# Altium schematic sheet Sm_Rt_LED_Bu.SchDoc
size A4
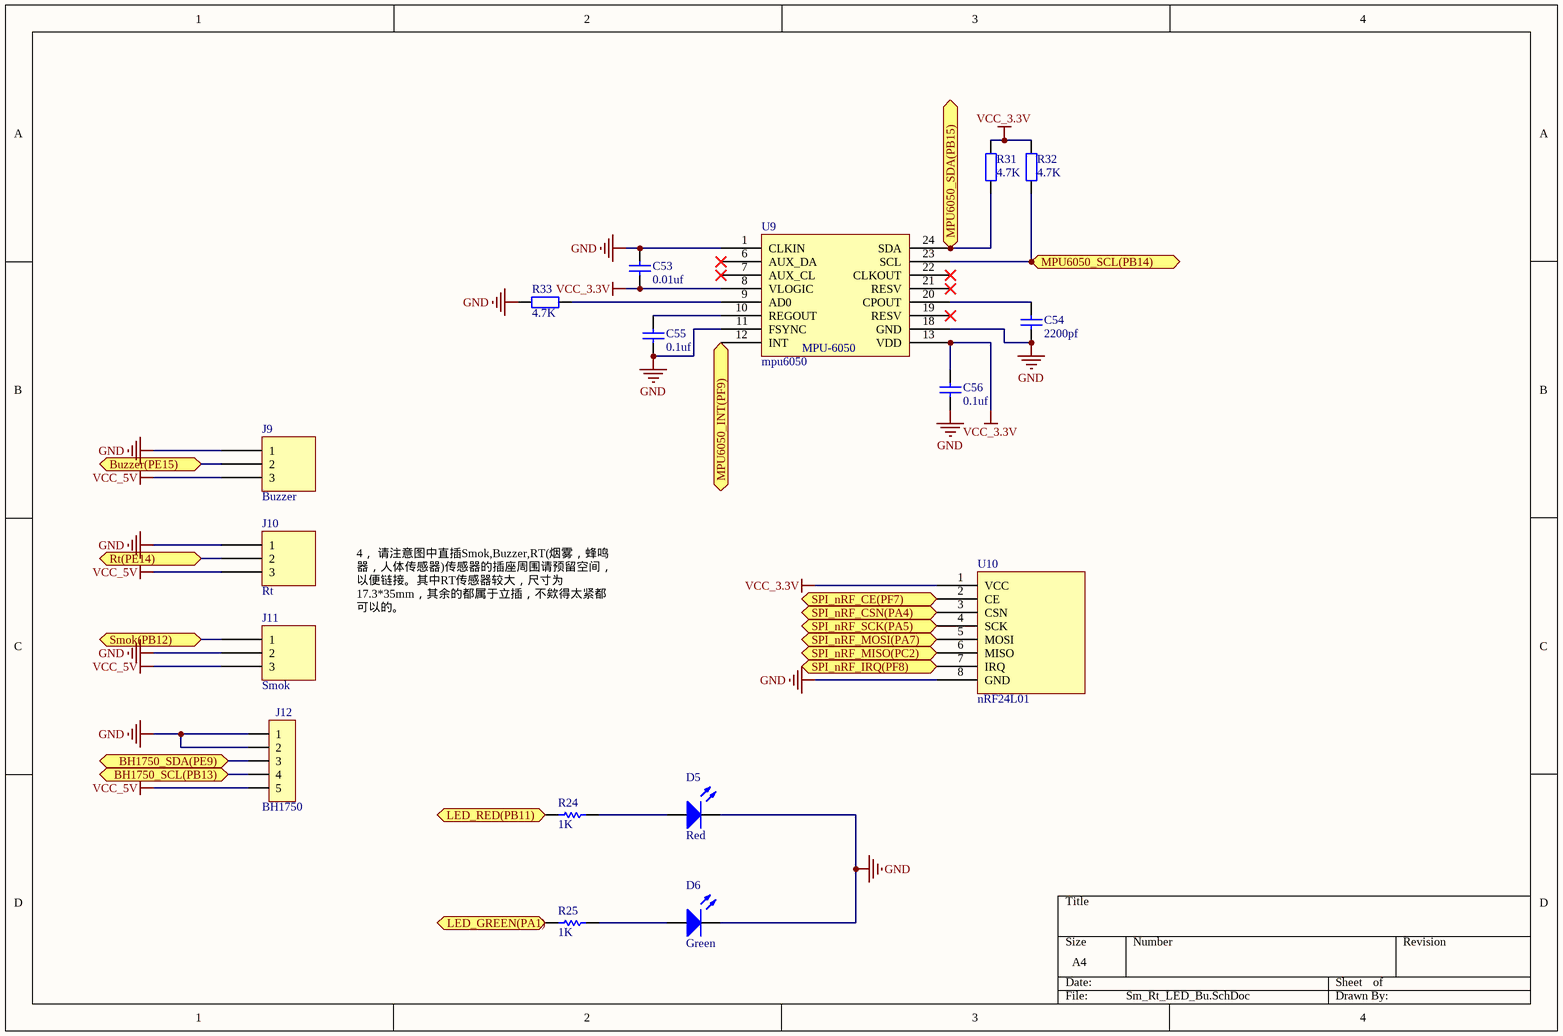
[diagram p0: Sm_Rt_LED_Bu.SchDoc]

## Parts
C53  0.01uf  [0603_C]
C54  2200pf  [0603_C]
C55  0.1uf  [0603_C]
C56  0.1uf  [0603_C]
D5  Red  [0805_LED_S1]
D6  Green  [0805_LED_S1]
J9  Buzzer  [HDR1X3]
J10  Rt  [HDR1X3]
J11  Smok  [HDR1X3]
J12  BH1750  [XH2.54-LI-5P]
R24  1K  [0603_R]
R25  1K  [0603_R]
R31  4.7K  [0603_R]
R32  4.7K  [0603_R]
R33  4.7K  [0603_R]
U9  mpu6050  [QFN-24_4x4x05P]
U10  nRF24L01  [AS01-spipx]

## Ports
BH1750_SCL(PB13) (bidir), BH1750_SDA(PE9) (bidir), Buzzer(PE15) (bidir), LED_GREEN(PA1) (bidir), LED_RED(PB11) (bidir), MPU6050_INT(PF9) (bidir), MPU6050_SCL(PB14) (bidir), MPU6050_SDA(PB15) (bidir), Rt(PE14) (bidir), Smok(PB12) (bidir), SPI_nRF_CE(PF7) (bidir), SPI_nRF_CSN(PA4) (bidir), SPI_nRF_IRQ(PF8) (bidir), SPI_nRF_MISO(PC2) (bidir), SPI_nRF_MOSI(PA7) (bidir), SPI_nRF_SCK(PA5) (bidir)

## Nets
GND: C53.2 C54.1 C55.1 C56.1 D5.K D6.K J9.1 J10.1 J11.2 J12.1 J12.2 R33.2 U9.1(CLKIN) U9.11(FSYNC) U9.18(GND) U10.8(GND)
VCC_3.3V: C53.1 C56.2 R31.2 R32.2 U9.8(VLOGIC) U9.13(VDD) U10.1(VCC)
VCC_5V: J9.3 J10.3 J11.3 J12.5
BH1750_SCL(PB13): J12.4 ; port BH1750_SCL(PB13)
BH1750_SDA(PE9): J12.3 ; port BH1750_SDA(PE9)
Buzzer(PE15): J9.2 ; port Buzzer(PE15)
LED_GREEN(PA1): R25.1 ; port LED_GREEN(PA1)
LED_RED(PB11): R24.1 ; port LED_RED(PB11)
MPU6050_INT(PF9): U9.12(INT) ; port MPU6050_INT(PF9)
MPU6050_SCL(PB14): R32.1 U9.23(SCL) ; port MPU6050_SCL(PB14)
MPU6050_SDA(PB15): R31.1 U9.24(SDA) ; port MPU6050_SDA(PB15)
Rt(PE14): J10.2 ; port Rt(PE14)
Smok(PB12): J11.1 ; port Smok(PB12)
SPI_nRF_CE(PF7): U10.2(CE) ; port SPI_nRF_CE(PF7)
SPI_nRF_CSN(PA4): U10.3(CSN) ; port SPI_nRF_CSN(PA4)
SPI_nRF_IRQ(PF8): U10.7(IRQ) ; port SPI_nRF_IRQ(PF8)
SPI_nRF_MISO(PC2): U10.6(MISO) ; port SPI_nRF_MISO(PC2)
SPI_nRF_MOSI(PA7): U10.5(MOSI) ; port SPI_nRF_MOSI(PA7)
SPI_nRF_SCK(PA5): U10.4(SCK) ; port SPI_nRF_SCK(PA5)
NetC54_2: C54.2 U9.20(CPOUT)
NetC55_2: C55.2 U9.10(REGOUT)
NetD5_A: D5.A R24.2
NetD6_A: D6.A R25.2
NetR33_1: R33.1 U9.9(AD0)

Not connected (* = marked no-connect by the designer): U9 6(AUX_DA)* 7(AUX_CL)* 19(RESV)* 21(RESV)* 22(CLKOUT)*

## Notes on the sheet
- 4，	请注意图中直插Smok,Buzzer,RT(烟雾，蜂鸣器，人体传感器)传感器的插座周围请预留空间，以便链接。其中RT传感器较大，尺寸为17.3*35mm，其余的都属于立插，不欸得太紧都可以的。
- (in symbol mpu6050) MPU-6050

## Library data of the parts
C53-C56 = CAP-0603: 贴片电容
D5 = LED_Red: 直插
D6 = LED_Green: 直插
J9-J11 = Component_2
J12 = Header 5: 5P接插件
R24 R25 = Res1: Resistor
R31-R33 = Res-0603: 贴片电阻
U10 = Component_9